# EAGLE design flackerlicht (EAGLE 6.3)
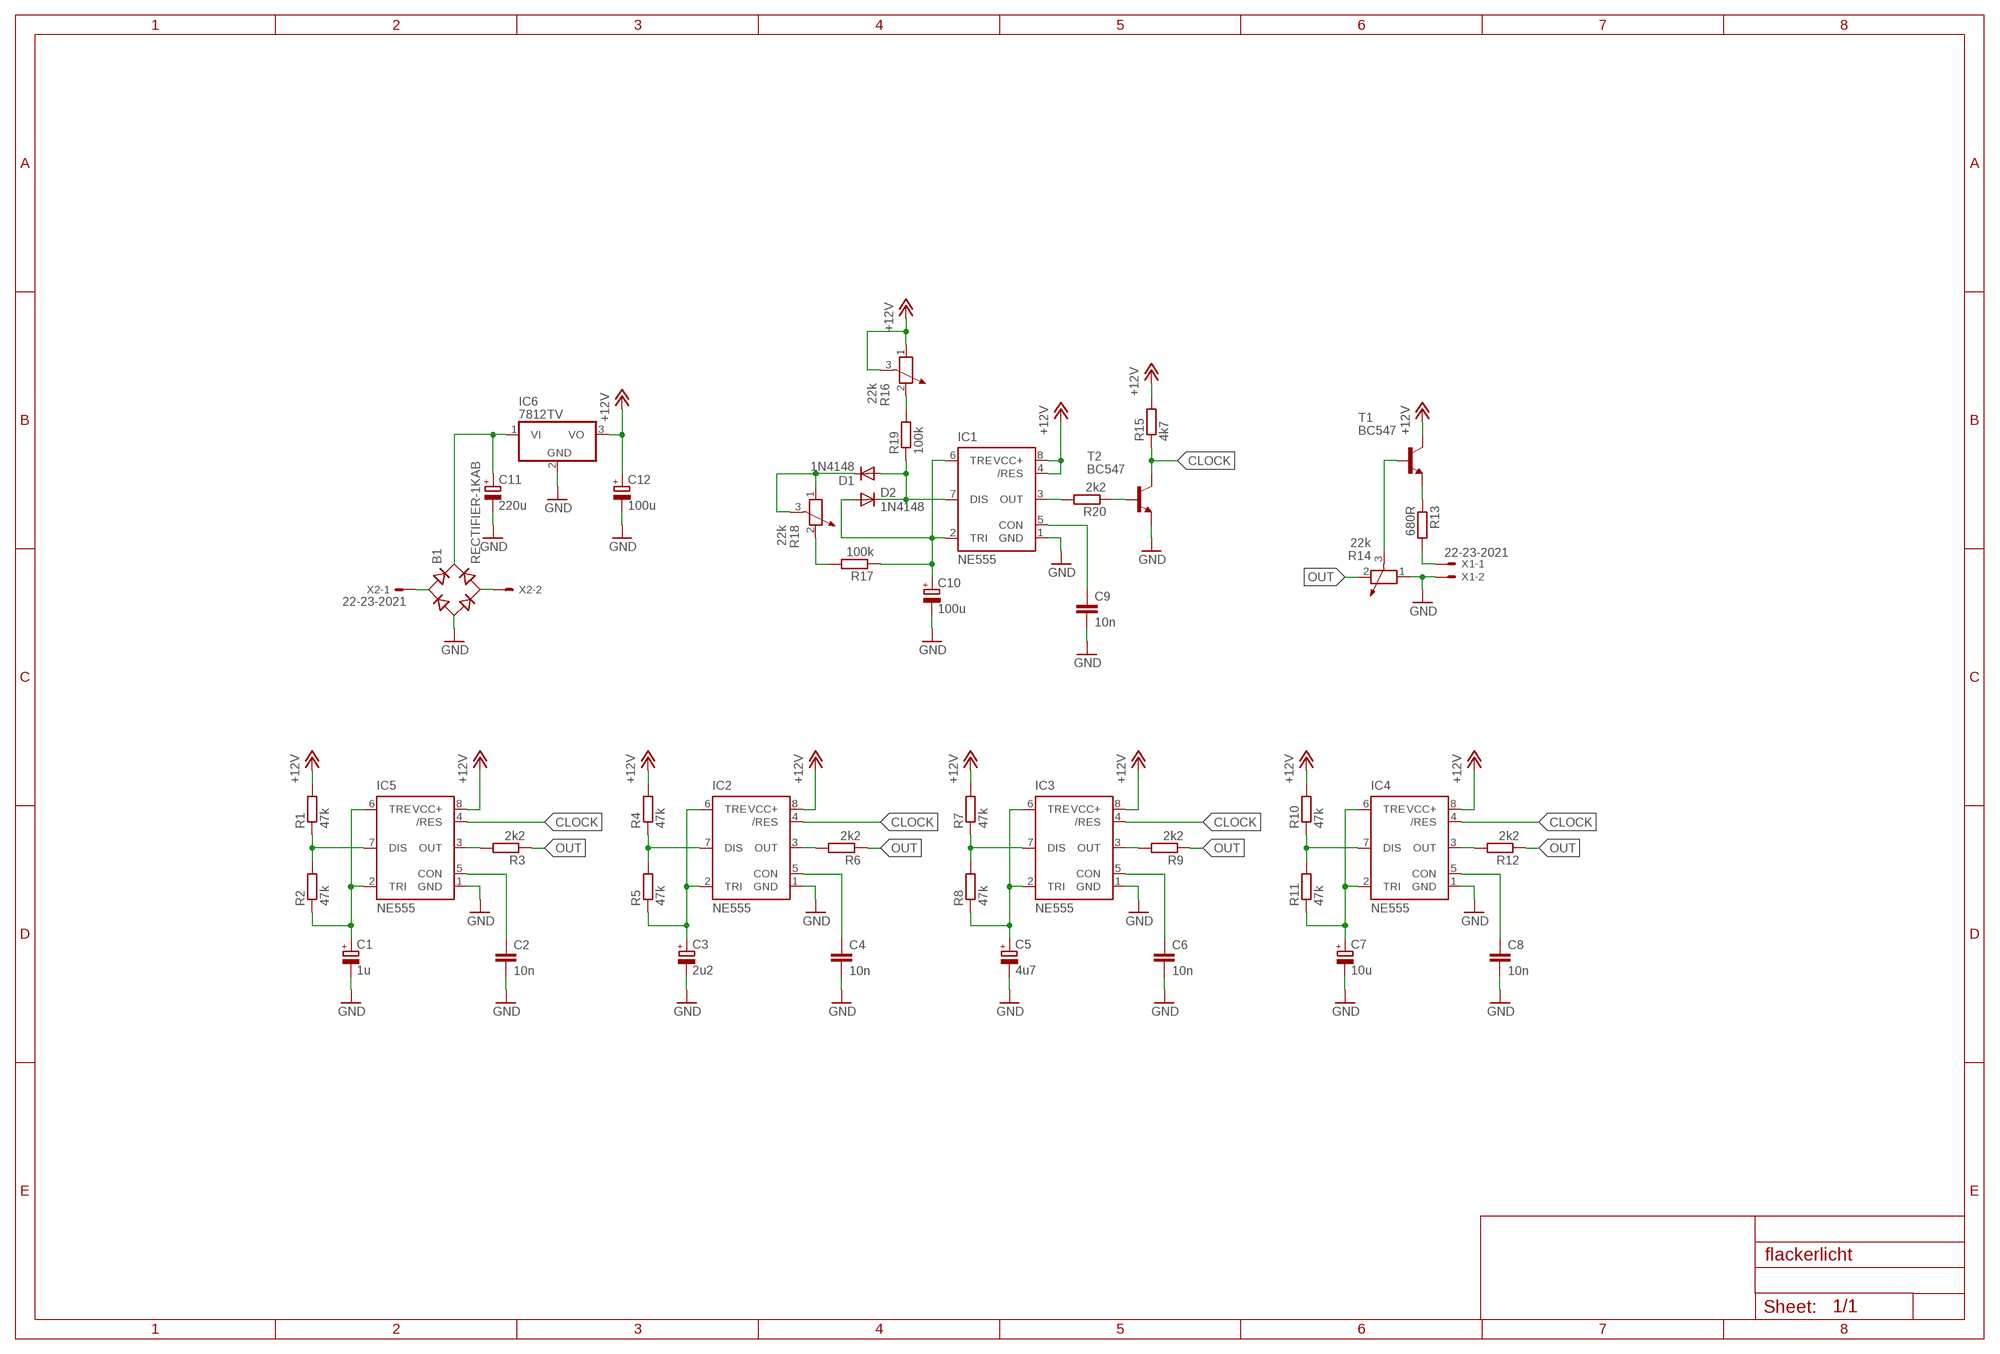
[diagram p0: schematic, sheet 1]

## Parts
B1  RECTIFIER-1KAB  [1KAB]
C1  1u  CPOL-EUE2.5-6  [E2,5-6]
C2  10n  C-EU050-035X075  [C050-035X075]
C3  2u2  CPOL-EUE2.5-6  [E2,5-6]
C4  10n  C-EU050-035X075  [C050-035X075]
C5  4u7  CPOL-EUE2.5-6  [E2,5-6]
C6  10n  C-EU050-035X075  [C050-035X075]
C7  10u  CPOL-EUE2.5-6  [E2,5-6]
C8  10n  C-EU050-035X075  [C050-035X075]
C9  10n  C-EU050-035X075  [C050-035X075]
C10  100u  CPOL-EUE3.5-8  [E3,5-8]
C11  220u  CPOL-EUE3.5-8  [E3,5-8]
C12  100u  CPOL-EUE3.5-8  [E3,5-8]
D1  1N4148  1N4148DO35-10  [DO35-10]
D2  1N4148  1N4148DO35-10  [DO35-10]
IC1  NE555  [DIL-08]
IC2  NE555  [DIL-08]
IC3  NE555  [DIL-08]
IC4  NE555  [DIL-08]
IC5  NE555  [DIL-08]
IC6  7812TV  [TO220V]
R1  47k  R-EU_0309/10  [0309/10]
R2  47k  R-EU_0309/10  [0309/10]
R3  2k2  R-EU_0309/10  [0309/10]
R4  47k  R-EU_0309/10  [0309/10]
R5  47k  R-EU_0309/10  [0309/10]
R6  2k2  R-EU_0309/10  [0309/10]
R7  47k  R-EU_0309/10  [0309/10]
R8  47k  R-EU_0309/10  [0309/10]
R9  2k2  R-EU_0309/10  [0309/10]
R10  47k  R-EU_0309/10  [0309/10]
R11  47k  R-EU_0309/10  [0309/10]
R12  2k2  R-EU_0309/10  [0309/10]
R13  680R  R-EU_0309/10  [0309/10]
R14  22k  POTENTIOMETER_PT-10  [PT-10]
R15  4k7  R-EU_0309/10  [0309/10]
R16  22k  POTENTIOMETER_PT-10  [PT-10]
R17  100k  R-EU_0309/10  [0309/10]
R18  22k  POTENTIOMETER_PT-10  [PT-10]
R19  100k  R-EU_0309/10  [0309/10]
R20  2k2  R-EU_0309/10  [0309/10]
T1  BC547  [TO92]
T2  BC547  [TO92]
X1  22-23-2021  [22-23-2021]
X2  22-23-2021  [22-23-2021]

## Nets
+12V: C12.+ IC1.4(/RES) IC1.8(VCC+) IC2.8(VCC+) IC3.8(VCC+) IC4.8(VCC+) IC5.8(VCC+) IC6.3(VO) R1.2 R4.2 R7.2 R10.2 R15.2 R16.1 R16.3 T1.3(C)
CLOCK: IC2.4(/RES) IC3.4(/RES) IC4.4(/RES) IC5.4(/RES) R15.1 T2.3(C)
GND: B1.- C1.- C2.2 C3.- C4.2 C5.- C6.2 C7.- C8.2 C9.2 C10.- C11.- C12.- IC1.1(GND) IC2.1(GND) IC3.1(GND) IC4.1(GND) IC5.1(GND) IC6.2(GND) R14.1 T2.1(E) X1.2
N$1: IC5.7(DIS) R1.1 R2.2
N$2: C1.+ IC5.2(TRI) IC5.6(TRE) R2.1
N$3: IC5.3(OUT) R3.2
N$4: C2.1 IC5.5(CON)
N$5: IC2.7(DIS) R4.1 R5.2
N$6: C3.+ IC2.2(TRI) IC2.6(TRE) R5.1
N$7: IC2.3(OUT) R6.2
N$8: C4.1 IC2.5(CON)
N$9: IC3.7(DIS) R7.1 R8.2
N$10: C5.+ IC3.2(TRI) IC3.6(TRE) R8.1
N$11: IC3.3(OUT) R9.2
N$12: C6.1 IC3.5(CON)
N$13: IC4.7(DIS) R10.1 R11.2
N$14: C7.+ IC4.2(TRI) IC4.6(TRE) R11.1
N$15: IC4.3(OUT) R12.2
N$16: C8.1 IC4.5(CON)
N$17: R13.1 T1.1(E)
N$18: R13.2 X1.1
N$20: R14.3 T1.2(B)
N$21: IC1.3(OUT) R20.2
N$22: C9.1 IC1.5(CON)
N$23: D1.A D2.C IC1.7(DIS) R19.1
N$24: C10.+ D2.A IC1.2(TRI) IC1.6(TRE) R17.1
N$25: D1.C R18.1 R18.3
N$26: B1.AC1 X2.1
N$27: R17.2 R18.2
N$28: R16.2 R19.2
N$29: B1.AC2 X2.2
N$30: B1.+ C11.+ IC6.1(VI)
N$31: R20.1 T2.2(B)
OUT: R3.1 R6.1 R9.1 R12.1 R14.2

## Library data of the parts
B1 = rectifier:RECTIFIER-: Rectifier
C1 C3 C5 C7 C10-C12 = rcl:CPOL-EU: POLARIZED CAPACITOR, European symbol
C2 C4 C6 C8 C9 = rcl:C-EU: CAPACITOR, European symbol
D1 D2 = diode:1N4148: DIODE high speed (Philips)
IC1-IC5 = st-microelectronics:NE555: General purpose bipolar Timer; MF: Arrow Electronics; MPN: NE555N; OC_FARNELL: 1467742; OC_NEWARK: 89K1486
IC6 = linear:78*: Positive VOLTAGE REGULATOR Source: http://cache.national.com/ds/LM/LM78L05.pdf http://www.fairchildsemi.com/ds/LM/LM7805.pdf
R1-R13 R15 R17 R19 R20 = rcl:R-EU_: RESISTOR, European symbol
R14 R16 R18 = rcl:POTENTIOMETER_: Potentiometer
T1 T2 = transistor:BC547: NPN TRANSISTOR
X1 X2 = con-molex:22-23-2021: .100" (2.54mm) Center Header - 2 Pin; MF: MOLEX; MPN: 22-23-2021; OC_FARNELL: 1462926; OC_NEWARK: 25C3832

## Board
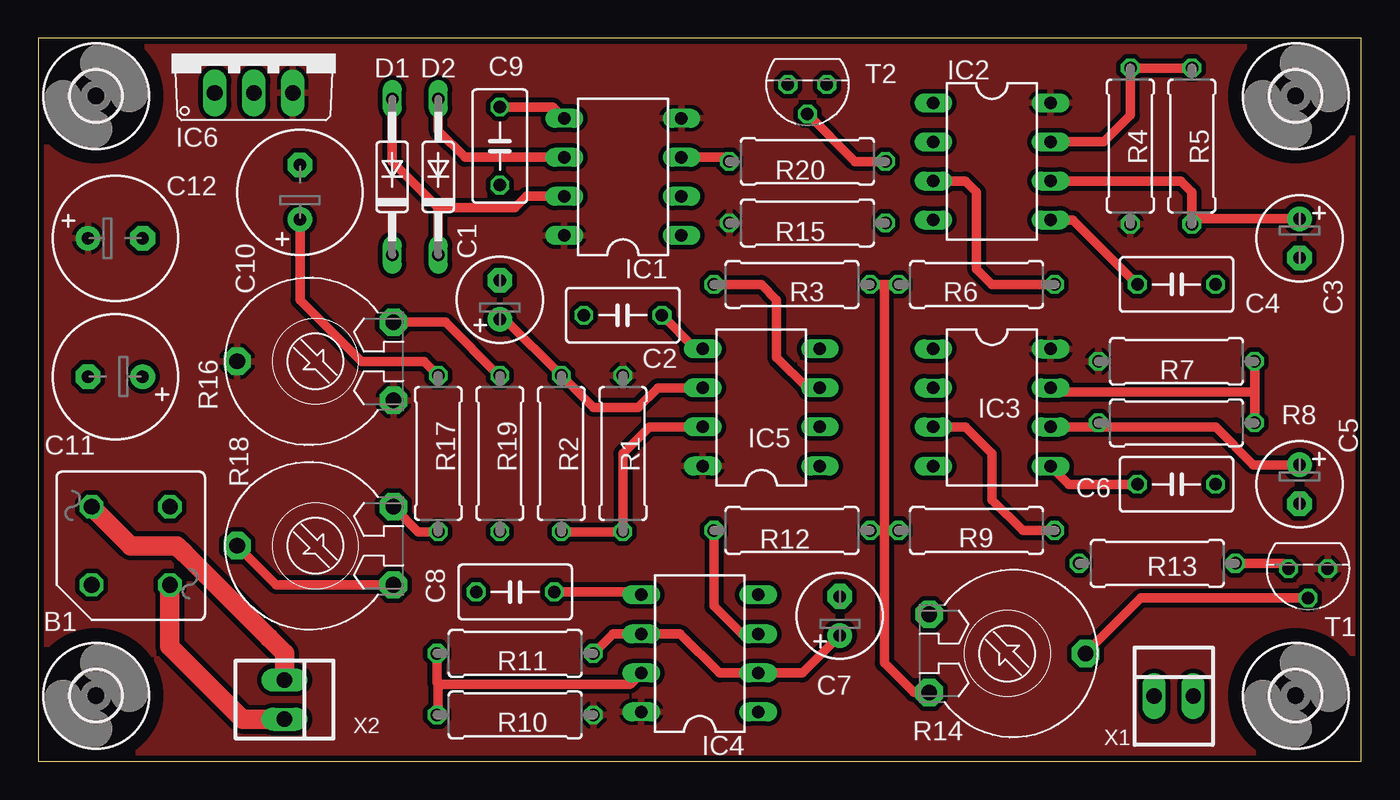
[diagram p1: board, top side]
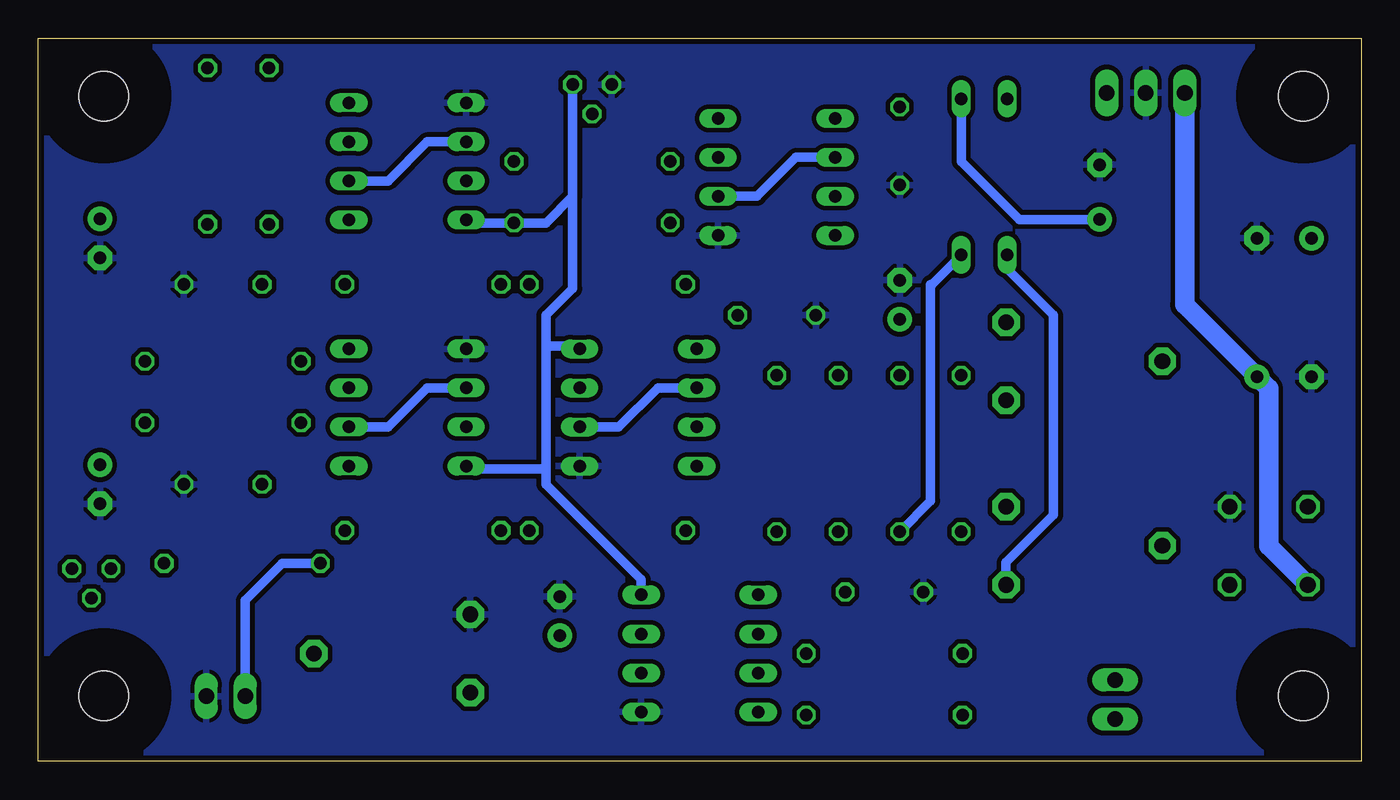
[diagram p2: board, bottom side, seen from below]

Size 86 x 47 mm. Coordinates in mm from the lower left corner, seen from the top.
Outline: 0,0 86,0 86,47 0,47 0,0
Copper layers (1*16): Top 0.0356mm / dielectric 1.5011mm / Bottom 0.0356mm
Design rules "oshPark2Layer": minimum track width 6mil, minimum drill 13mil, track to track 6mil, track to pad 6mil, pad to pad 6mil, via to via 6mil, smd to smd 6mil, copper to edge 15mil, drill to drill 6mil, minimum pad ring 7mil, minimum via ring 7mil, stop-mask expansion 3mil, vias tented up to drill 0mil, thermal gap 10mil

### Footprints (pad centres in the part's own frame; a part is rotated, then mirrored left to right if it is on the bottom)
1KAB = drill 1.016 octagon: + 2.54,-2.54; - -2.54,2.54; AC1 -2.54,-2.54; AC2 2.54,2.54
E2,5-6 = drill 0.813 pad 1.6: + -1.27,0 | drill 0.813 pad 1.6 octagon: - 1.27,0
C050-035X075 = drill 0.813 octagon: 1 -2.54,0; 2 2.54,0
E3,5-8 = drill 0.813 pad 1.6: + -1.778,0 | drill 0.813 pad 1.6 octagon: - 1.778,0
DO35-10 = drill 0.813 long: A 5.08,0; C -5.08,0
DIL-08 = drill 0.813 long: 1 -3.81,-3.81; 2 -1.27,-3.81; 3 1.27,-3.81; 4 3.81,-3.81; 5 3.81,3.81; 6 1.27,3.81; 7 -1.27,3.81; 8 -3.81,3.81
TO220V = drill 1.016 long: 1 -2.54,-2.54; 2 0,-2.54; 3 2.54,-2.54
0309/10 = drill 0.813 octagon: 1 -5.08,0; 2 5.08,0
PT-10 = drill 1.016 pad 1.778 octagon: 1 -2.54,-5.08; 2 2.54,-5.08; 3 0,5.08
TO92 = drill 0.813 octagon: 1 1.27,0; 2 0,1.905; 3 -1.27,0
3,2 = hole 3.2: 0,0
22-23-2021 = drill 1 long: 1 -1.27,0; 2 1.27,0

### Placement (x,y rotation side)
B1  6,14 270 top
C1  30,30 90 top
C2  38,29 180 top
C3  82,34 270 top
C4  74,31 0 top
C5  82,18 270 top
C6  74,18 0 top
C7  52.11,9.44 90 top
C8  31,11 180 top
C9  30,40 270 top
C10  17,37 90 top
C11  5,25 180 top
C12  5,34 0 top
D1  23,38 90 top
D2  26,38 90 top
IC1  38,38 90 top
IC2  62,39 270 top
IC3  62,23 270 top
IC4  43,7 90 top
IC5  47,23 90 top
IC6  14,46 0 top
R1  38,20 90 top
R2  34,20 270 top
R3  49,31 180 top
R4  71,40 270 top
R5  75,40 90 top
R6  61,31 0 top
R7  74,26 180 top
R8  74,22 0 top
R9  61,15 0 top
R10  31,3 0 top
R11  31,7 180 top
R12  49,15 180 top
R13  72.75,12.86 180 top
R14  63,7 270 top
R15  50,35 180 top
R16  18,26 90 top
R17  26,20 270 top
R18  18,14 90 top
R19  30,20 90 top
R20  50,39 180 top
T1  82.56,12.51 180 top
T2  50,44 180 top
U$1  [3,2]  81.75,4.25 0 top
U$2  [3,2]  81.75,43.25 0 top
U$3  [3,2]  3.75,4.25 0 top
U$4  [3,2]  3.75,43.25 0 top
X1  73.82,4.22 0 top
X2  16,4 270 top

### Tracks (layer width: path | path; a pad name or v marks a point on that pad's centre or on a via)
+12V
  pour Top (isolate 0.305): -1,-1 87,-1 87,48 -1,48
CLOCK
  Bottom 0.61: T2.3 51.27,36.73 | 51.27,36.73 53,35 R15.1 58,35 IC2.4 | IC4.4 46.81,11.81 53,18 53,19 | 53,19 53,27 | 53,27 53,29 51.27,30.73 51.27,36.73 | 53,19 57.62,19 57.81,19.19 IC3.4 | IC5.4 51,27 53,27
GND
  pour Bottom (isolate 0.305): -2,49 88,49 88,-2 -2,-2
N$1
  Top 0.61: IC5.7 39.73,21.73 38,20 R1.1 R2.2
N$2
  Top 0.61: IC5.6 40.27,24.27 39,23 36.08,23 R2.1 30.35,28.73 C1.+
  Bottom 0.61: IC5.2 48.27,21.73 45.73,24.27 IC5.6
N$3
  Top 0.61: IC5.3 50,24.25 48,26.25 48,30 47,31 R3.2
N$4
  Top 0.61: IC5.5 42.73,26.81 C2.1
N$5
  Top 0.61: R5.2 R4.1 71,42 69.27,40.27 IC2.7
N$6
  Top 0.61: IC2.6 74.27,37.73 75,37 R5.1 75.35,35.27 C3.+
  Bottom 0.61: IC2.2 60.73,40.27 63.27,37.73 IC2.6
N$7
  Top 0.61: IC2.3 60.27,37.73 61,37 61,32 62,31 R6.2
N$8
  Top 0.61: IC2.5 67.27,35.19 C4.1
N$9
  Top 0.61: R7.1 79.08,24 | 79.08,24 R8.2 | IC3.7 66.08,24 79.08,24
N$10
  Top 0.61: C5.+ 79,19.27 76.54,21.73 69,21.73 | IC3.6 69,21.73 | R8.1 68.92,21.81 69,21.73
  Bottom 0.61: IC3.6 63.27,21.73 60.73,24.27 IC3.2
N$11
  Top 0.61: IC3.3 60.27,21.73 62,20 62,17 64,15 R9.2
N$12
  Top 0.61: IC3.5 67,18 C6.1
N$13
  Top 0.61: IC4.7 38.46,5 26,5 | 26,5 25.92,5.08 R11.2 | R10.1 26,3.08 26,5
N$14
  Top 0.61: R11.1 37.35,8.27 IC4.6 41.73,8.27 44.27,5.73 IC4.2 49.67,5.73 C7.+
N$15
  Top 0.61: R12.2 43.92,10.08 45.73,8.27 IC4.3
N$16
  Top 0.61: IC4.5 39,11 C8.1
N$17
  Top 0.61: T1.1 80.94,12.86 R13.1
N$18
  Bottom 0.61: R13.2 70.14,12.86 72.55,10.45 X1.1
N$20
  Top 0.61: R14.3 71.69,10.61 T1.2
N$21
  Top 0.61: IC1.3 44.65,39.27 R20.2
N$22
  Top 0.61: IC1.5 33.46,42.54 C9.1
N$23
  Top 0.61: D2.C 26,36 | 26,36 23,39 D1.A | IC1.7 31.73,36.73 31,36 26,36
  Bottom 0.61: R19.1 28,16.92 28,31 27.92,31 D2.C
N$24
  Top 0.61: C10.+ 17,30 21,26 25.08,26 R17.1 | IC1.6 27.73,39.27 26,41 D2.A
  Bottom 0.61: IC1.2 39.27,36.73 36.73,39.27 IC1.6 | C10.+ 22.22,35.22 26,39 D2.A
N$25
  Top 0.61: R18.1 15.46,11.46 R18.3
  Bottom 0.61: D1.C 23,32 20,29 20,16 23.08,12.92 R18.1
N$26
  Top 1.27: B1.AC1 6,14 9,14 9.5,13.5 15,8 16,7 X2.1
N$27
  Top 0.61: R17.2 24.7,14.92 R18.2
N$28
  Top 0.61: R19.2 29.92,25.08 26.46,28.54 R16.2
N$29
  Top 1.27: X2.2 13.27,2.73 8.54,7.46 B1.AC2
N$30
  Bottom 1.27: B1.+ 6,14 6,24.22 C11.+ 11.46,29.68 IC6.1
N$31
  Top 0.61: R20.1 53.09,39 T2.2
OUT
  Top 0.61: R3.1 55,31 | 55,31 R6.1 | R9.1 55,15 | 55,15 55,31 | 55,15 R12.1 | 55,15 55,6.38 56.92,4.46 R14.2